# Altium schematic sheet stepper.SchDoc
size A3
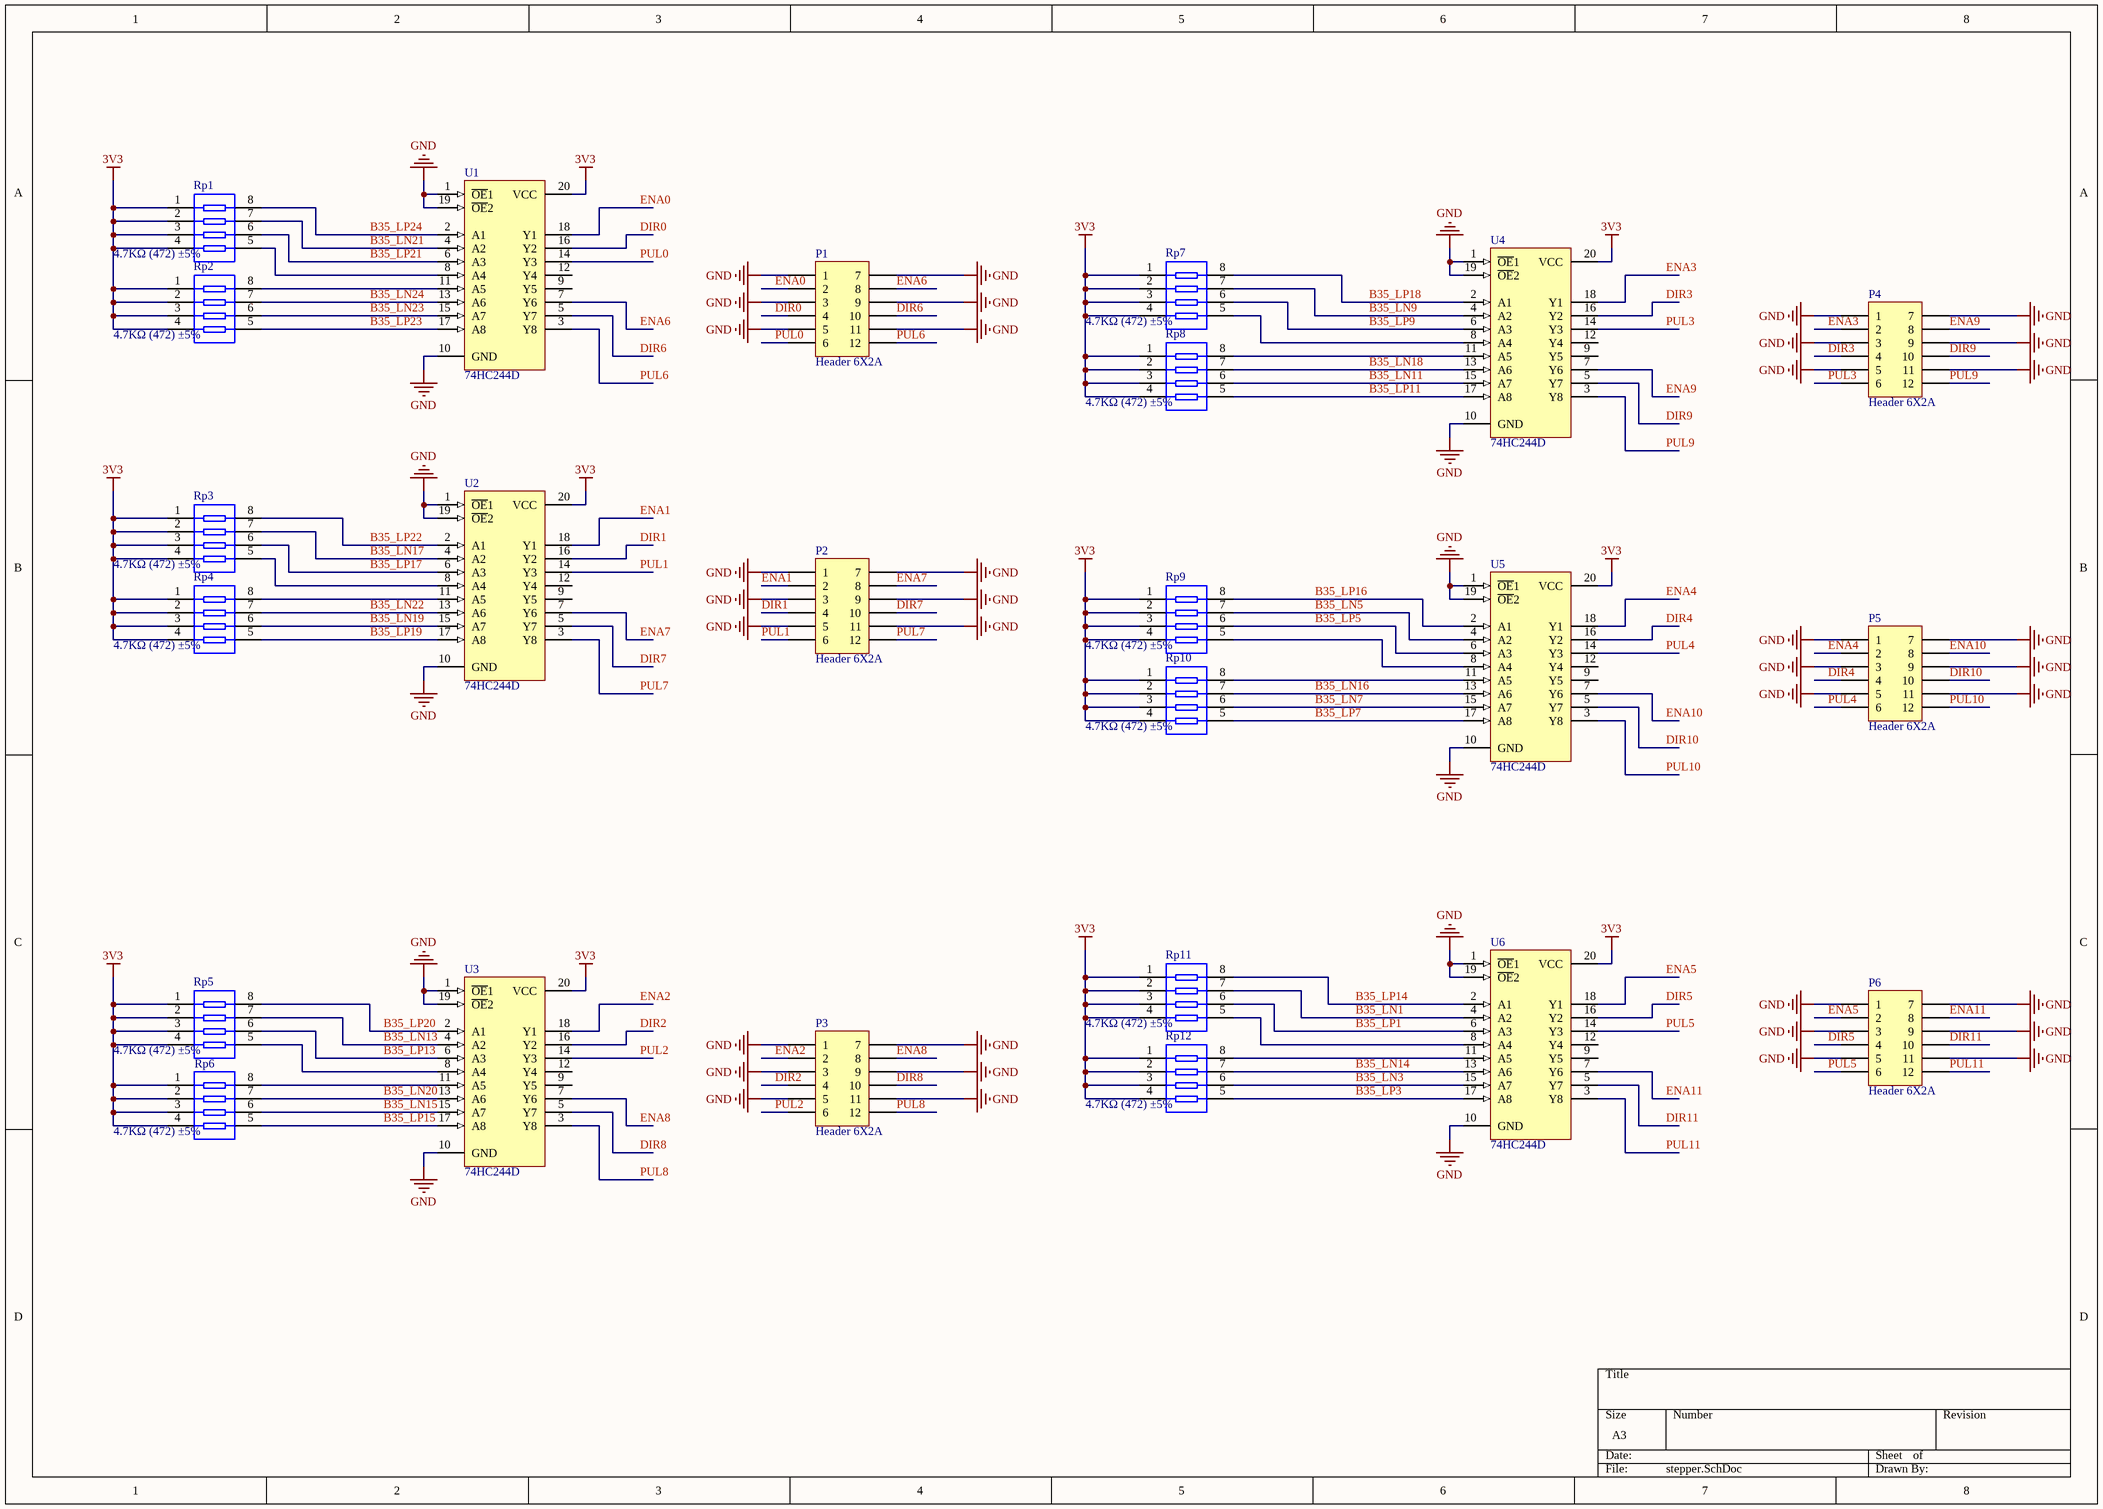
[diagram p0: stepper.SchDoc]

## Parts
P1  Header 6X2A  [2EDG-3.81-06P*2 - duplicate]
P2  Header 6X2A  [2EDG-3.81-06P*2 - duplicate]
P3  Header 6X2A  [2EDG-3.81-06P*2 - duplicate]
P4  Header 6X2A  [2EDG-3.81-06P*2 - duplicate]
P5  Header 6X2A  [2EDG-3.81-06P*2 - duplicate]
P6  Header 6X2A  [2EDG-3.81-06P*2 - duplicate]
Rp1  4.7KΩ (472) ±5%  [0603_Rx4]
Rp2  4.7KΩ (472) ±5%  [0603_Rx4]
Rp3  4.7KΩ (472) ±5%  [0603_Rx4]
Rp4  4.7KΩ (472) ±5%  [0603_Rx4]
Rp5  4.7KΩ (472) ±5%  [0603_Rx4]
Rp6  4.7KΩ (472) ±5%  [0603_Rx4]
Rp7  4.7KΩ (472) ±5%  [0603_Rx4]
Rp8  4.7KΩ (472) ±5%  [0603_Rx4]
Rp9  4.7KΩ (472) ±5%  [0603_Rx4]
Rp10  4.7KΩ (472) ±5%  [0603_Rx4]
Rp11  4.7KΩ (472) ±5%  [0603_Rx4]
Rp12  4.7KΩ (472) ±5%  [0603_Rx4]
U1  74HC244D  [SOIC-20_300mil]
U2  74HC244D  [SOIC-20_300mil]
U3  74HC244D  [SOIC-20_300mil]
U4  74HC244D  [SOIC-20_300mil]
U5  74HC244D  [SOIC-20_300mil]
U6  74HC244D  [SOIC-20_300mil]

## Nets
3V3: Rp1.1 Rp1.2 Rp1.3 Rp1.4 Rp2.1 Rp2.2 Rp2.3 Rp2.4 Rp3.1 Rp3.2 Rp3.3 Rp3.4 Rp4.1 Rp4.2 Rp4.3 Rp4.4 Rp5.1 Rp5.2 Rp5.3 Rp5.4 Rp6.1 Rp6.2 Rp6.3 Rp6.4 Rp7.1 Rp7.2 Rp7.3 Rp7.4 Rp8.1 Rp8.2 Rp8.3 Rp8.4 Rp9.1 Rp9.2 Rp9.3 Rp9.4 Rp10.1 Rp10.2 Rp10.3 Rp10.4 Rp11.1 Rp11.2 Rp11.3 Rp11.4 Rp12.1 Rp12.2 Rp12.3 Rp12.4 U1.20(VCC) U2.20(VCC) U3.20(VCC) U4.20(VCC) U5.20(VCC) U6.20(VCC)
GND: P1.1 P1.3 P1.5 P1.7 P1.9 P1.11 P2.1 P2.3 P2.5 P2.7 P2.9 P2.11 P3.1 P3.3 P3.5 P3.7 P3.9 P3.11 P4.1 P4.3 P4.5 P4.7 P4.9 P4.11 P5.1 P5.3 P5.5 P5.7 P5.9 P5.11 P6.1 P6.3 P6.5 P6.7 P6.9 P6.11 U1.1(~{OE}1) U1.10(GND) U1.19(~{OE}2) U2.1(~{OE}1) U2.10(GND) U2.19(~{OE}2) U3.1(~{OE}1) U3.10(GND) U3.19(~{OE}2) U4.1(~{OE}1) U4.10(GND) U4.19(~{OE}2) U5.1(~{OE}1) U5.10(GND) U5.19(~{OE}2) U6.1(~{OE}1) U6.10(GND) U6.19(~{OE}2)
B35_LN1: Rp11.7 U6.4(A2)
B35_LN3: Rp12.6 U6.15(A7)
B35_LN5: Rp9.7 U5.4(A2)
B35_LN7: Rp10.6 U5.15(A7)
B35_LN9: Rp7.7 U4.4(A2)
B35_LN11: Rp8.6 U4.15(A7)
B35_LN13: Rp5.7 U3.4(A2)
B35_LN14: Rp12.7 U6.13(A6)
B35_LN15: Rp6.6 U3.15(A7)
B35_LN16: Rp10.7 U5.13(A6)
B35_LN17: Rp3.7 U2.4(A2)
B35_LN18: Rp8.7 U4.13(A6)
B35_LN19: Rp4.6 U2.15(A7)
B35_LN20: Rp6.7 U3.13(A6)
B35_LN21: Rp1.7 U1.4(A2)
B35_LN22: Rp4.7 U2.13(A6)
B35_LN23: Rp2.6 U1.15(A7)
B35_LN24: Rp2.7 U1.13(A6)
B35_LP1: Rp11.6 U6.6(A3)
B35_LP3: Rp12.5 U6.17(A8)
B35_LP5: Rp9.6 U5.6(A3)
B35_LP7: Rp10.5 U5.17(A8)
B35_LP9: Rp7.6 U4.6(A3)
B35_LP11: Rp8.5 U4.17(A8)
B35_LP13: Rp5.6 U3.6(A3)
B35_LP14: Rp11.8 U6.2(A1)
B35_LP15: Rp6.5 U3.17(A8)
B35_LP16: Rp9.8 U5.2(A1)
B35_LP17: Rp3.6 U2.6(A3)
B35_LP18: Rp7.8 U4.2(A1)
B35_LP19: Rp4.5 U2.17(A8)
B35_LP20: Rp5.8 U3.2(A1)
B35_LP21: Rp1.6 U1.6(A3)
B35_LP22: Rp3.8 U2.2(A1)
B35_LP23: Rp2.5 U1.17(A8)
B35_LP24: Rp1.8 U1.2(A1)
DIR0: P1.4 U1.16(Y2)
DIR1: P2.4 U2.16(Y2)
DIR2: P3.4 U3.16(Y2)
DIR3: P4.4 U4.16(Y2)
DIR4: P5.4 U5.16(Y2)
DIR5: P6.4 U6.16(Y2)
DIR6: P1.10 U1.5(Y7)
DIR7: P2.10 U2.5(Y7)
DIR8: P3.10 U3.5(Y7)
DIR9: P4.10 U4.5(Y7)
DIR10: P5.10 U5.5(Y7)
DIR11: P6.10 U6.5(Y7)
ENA0: P1.2 U1.18(Y1)
ENA1: P2.2 U2.18(Y1)
ENA2: P3.2 U3.18(Y1)
ENA3: P4.2 U4.18(Y1)
ENA4: P5.2 U5.18(Y1)
ENA5: P6.2 U6.18(Y1)
ENA6: P1.8 U1.7(Y6)
ENA7: P2.8 U2.7(Y6)
ENA8: P3.8 U3.7(Y6)
ENA9: P4.8 U4.7(Y6)
ENA10: P5.8 U5.7(Y6)
ENA11: P6.8 U6.7(Y6)
PUL0: P1.6 U1.14(Y3)
PUL1: P2.6 U2.14(Y3)
PUL2: P3.6 U3.14(Y3)
PUL3: P4.6 U4.14(Y3)
PUL4: P5.6 U5.14(Y3)
PUL5: P6.6 U6.14(Y3)
PUL6: P1.12 U1.3(Y8)
PUL7: P2.12 U2.3(Y8)
PUL8: P3.12 U3.3(Y8)
PUL9: P4.12 U4.3(Y8)
PUL10: P5.12 U5.3(Y8)
PUL11: P6.12 U6.3(Y8)
NetRp1_5: Rp1.5 U1.8(A4)
NetRp2_8: Rp2.8 U1.11(A5)
NetRp3_5: Rp3.5 U2.8(A4)
NetRp4_8: Rp4.8 U2.11(A5)
NetRp5_5: Rp5.5 U3.8(A4)
NetRp6_8: Rp6.8 U3.11(A5)
NetRp7_5: Rp7.5 U4.8(A4)
NetRp8_8: Rp8.8 U4.11(A5)
NetRp9_5: Rp9.5 U5.8(A4)
NetRp10_8: Rp10.8 U5.11(A5)
NetRp11_5: Rp11.5 U6.8(A4)
NetRp12_8: Rp12.8 U6.11(A5)

Not connected (* = marked no-connect by the designer): U1 9(Y5) 12(Y4); U2 9(Y5) 12(Y4); U3 9(Y5) 12(Y4); U4 9(Y5) 12(Y4); U5 9(Y5) 12(Y4); U6 9(Y5) 12(Y4)

## Library data of the parts
P1-P6 = Header 6X2A: Header, 6-Pin, Dual row; LatestRevisionDate: 17-Jul-2002; LatestRevisionNote: Re-released for DXP Platform.; Publisher: Altium Limited
Rp1-Rp12 = 0603*4  4.7KΩ (472) 5%: 贴片排阻; ComponentLink1Description: 供应商链接; ComponentLink1URL: http://www.szlcsc.com/product/details_2332.html; Package: 0603*4; Supplier: LC; SuppliersPartNumber: C1980
U1-U6 = 74HC244D_[C5622]: 74系列逻辑芯片; ComponentLink1Description: 供应商链接; ComponentLink1URL: http://www.szlcsc.com/product/details_6073.html; Package: SOIC-20_300mil; Supplier: LC; SuppliersPartNumber: C5622